# EAGLE design Starlings Technology nrf52 (EAGLE 9.6.2)
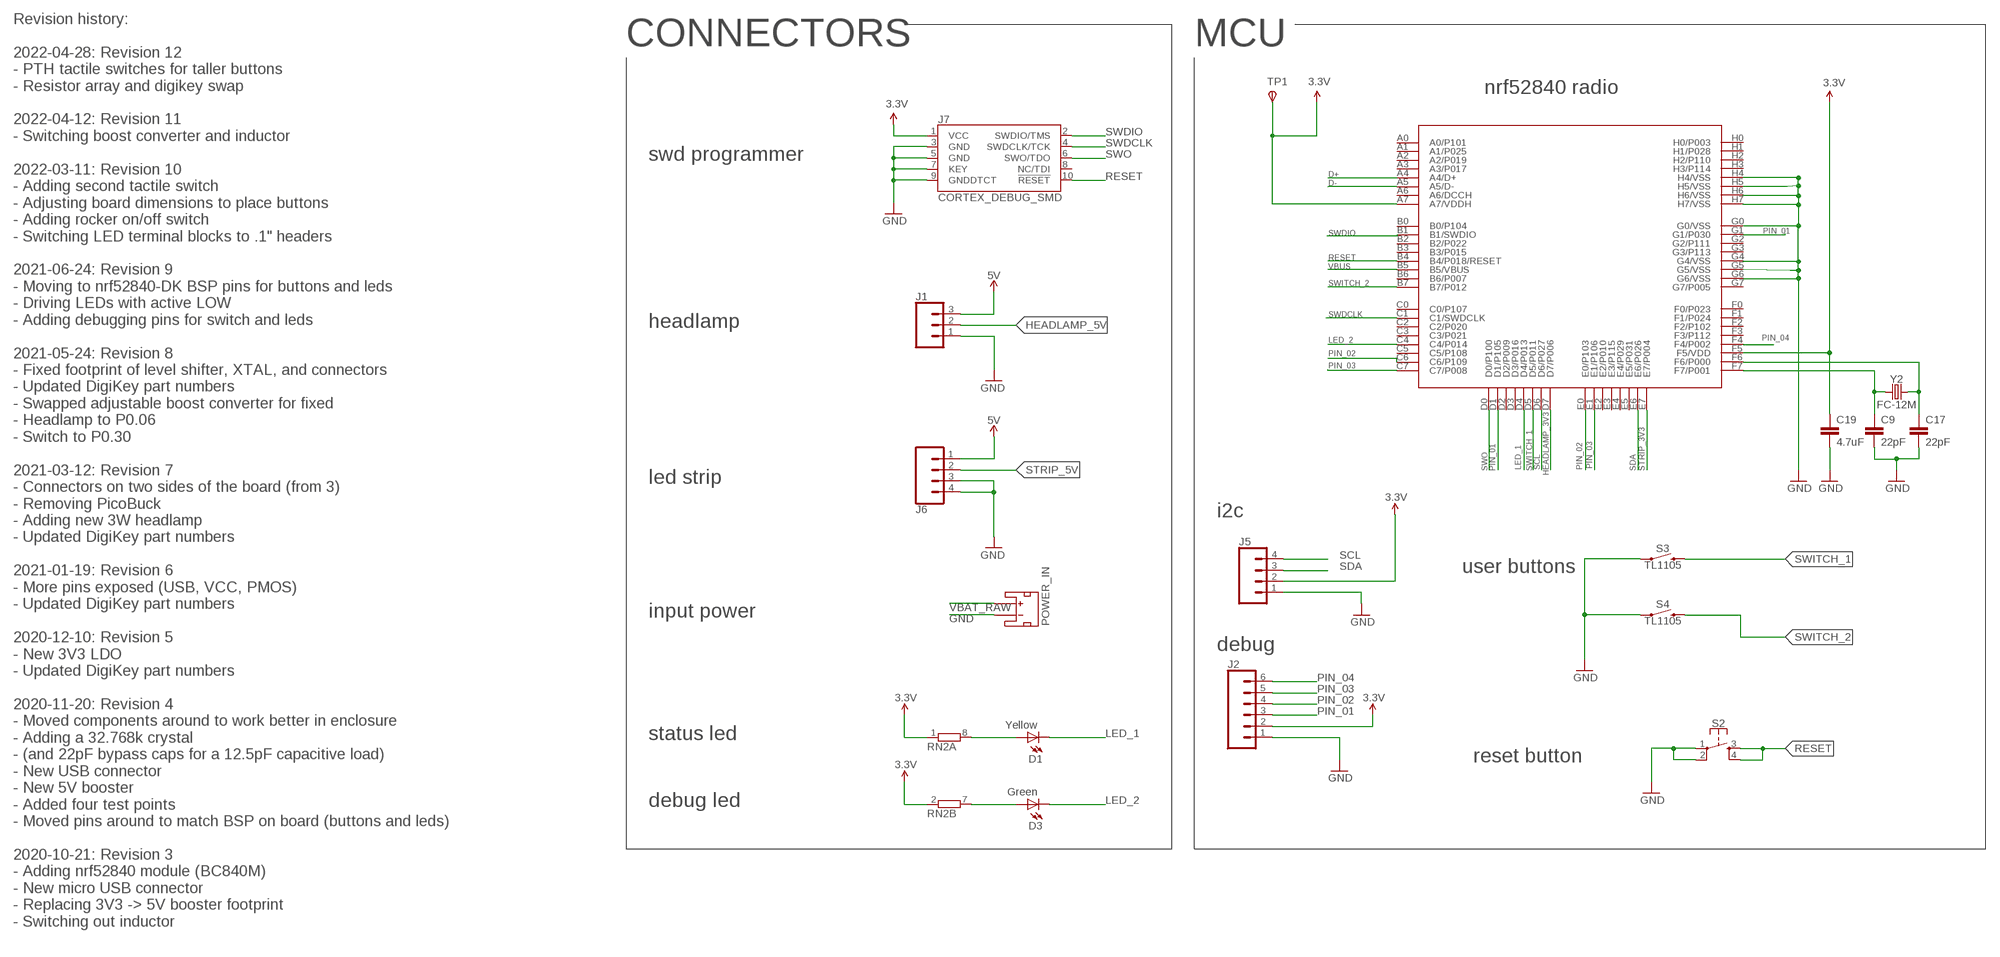
[diagram p0: schematic, sheet 1, part 1 of 2]
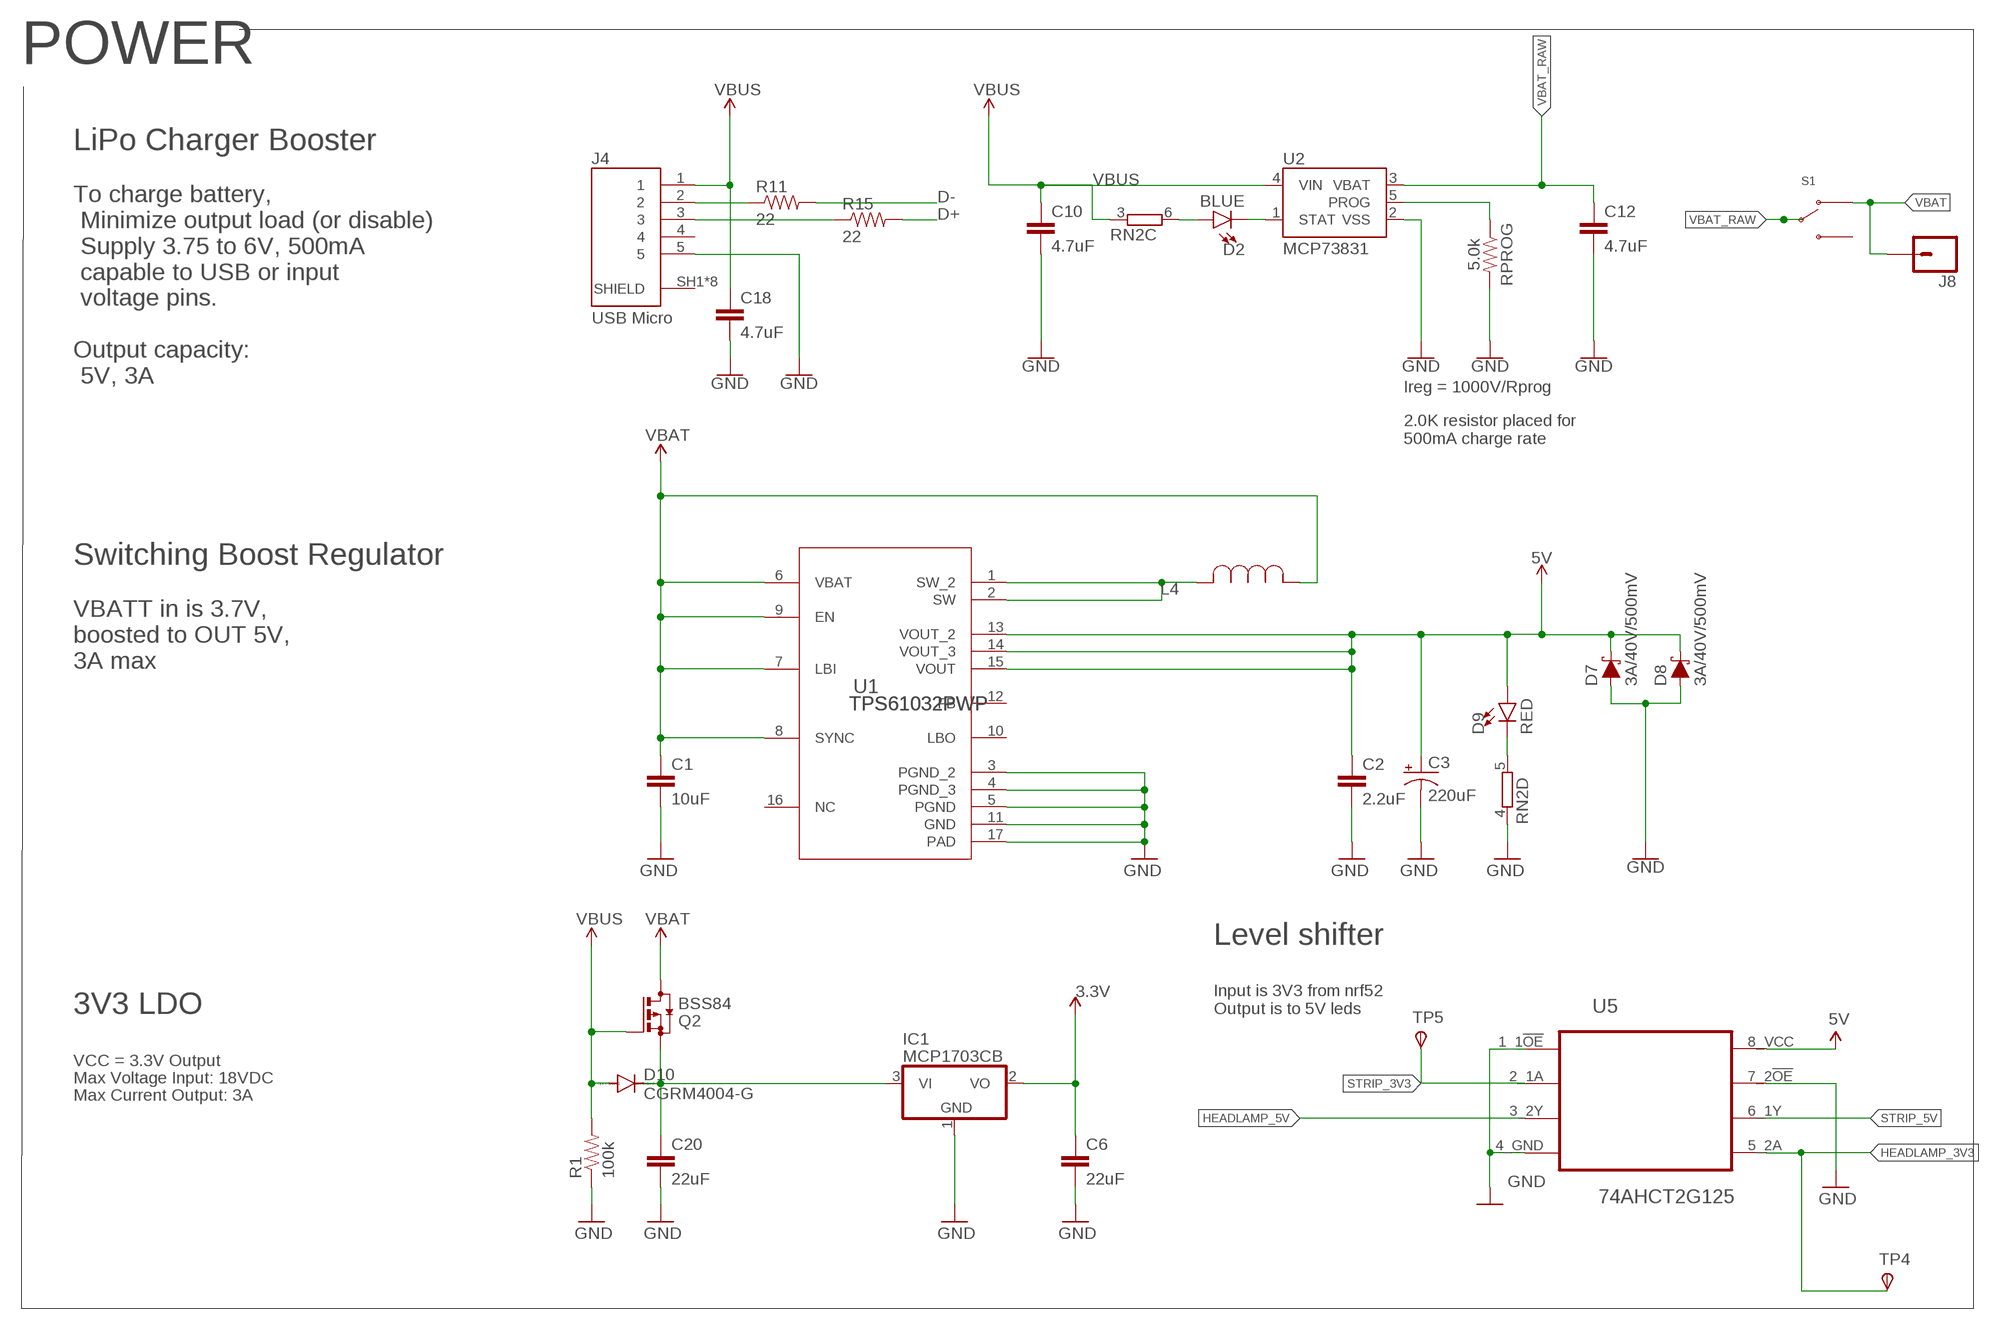
[diagram p1: schematic, sheet 1, part 2 of 2]

## Parts
C1  10uF  10UF-0603-6.3V-20%  [0603]
C2  2.2uF  10UF-0603-6.3V-20%  [0603]
C3  220uF  47UF-POLAR-EIA3528-10V-10%  [EIA3528]
C6  22uF  22UF-0805-6.3V-20%  [0805]
C9  22pF  22UF-0805-6.3V-20%  [0805]
C10  4.7uF  4.7UF0603  [0603]
C12  4.7uF  4.7UF0603  [0603]
C17  22pF  22UF-0805-6.3V-20%  [0805]
C18  4.7uF  4.7UF0603  [0603]
C19  4.7uF  4.7UF0603  [0603]
C20  22uF  22UF-0805-6.3V-20%  [0805]
D1  Yellow  LED0603  [LED-0603]
D2  BLUE  LED-BLUE0603  [LED-0603]
D3  Green  LED0603  [LED-0603]
D7  3A/40V/500mV  DIODE-SCHOTTKY-B340A  [SMA-DIODE]
D8  3A/40V/500mV  DIODE-SCHOTTKY-B340A  [SMA-DIODE]
D9  RED  LED-RED0603  [LED-0603]
D10  CGRM4004-G  [SOD-123_MINI-SMA]
IC1  MCP1703CB  [SOT23]
J1  CONN_03LOCK_LONGPADS  [1X03_LOCK_LONGPADS]
J2  CONN_06SMD-1MM  [1X06-1MM]
J4  USB Micro  1050170001  [MOLEX_1050170001]
J5  CONN_04SMD2  [1X04_1MM_RA]
J6  CONN_04LOCK_LONGPADS  [1X04_LOCK_LONGPADS]
J7  CORTEX_DEBUG_SMD  [SAMTECH_FTSH-105-01]
J8  CONN_01  [1X01]
L4  1.0 uH  SRR1260-330M  [IND_BOURNS_SRR1260]
POWER_IN  JST_2MM_MALE  [JST-2-SMD]
Q2  BSS84  [SOT23]
R1  100k  RESISTOR0603-RES  [0603-RES]
R11  22  RESISTOR0603-RES  [0603-RES]
R15  22  RESISTOR0603-RES  [0603-RES]
RN2  4R-NEXBS8V  [EXBS8V]
RPROG  5.0k  2.0KOHM-0603-1/10W-5%  [0603]
S1  CF-LD-1DC4-AR2W  [CF-LD-1DC4-AR2W]
S2  MOMENTARY-SWITCH-SPST-2-SMD-4.6X2.8MM  [TACTILE_SWITCH_SMD_4.6X2.8MM]
S3  TL1105  MOMENTARY-SWITCH-SPST-PTH-6.0MM  [TACTILE_SWITCH_PTH_6.0MM]
S4  TL1105  MOMENTARY-SWITCH-SPST-PTH-6.0MM  [TACTILE_SWITCH_PTH_6.0MM]
TP1  TPSB1,27  [B1,27]
TP4  TPSB1,27  [B1,27]
TP5  TPSB1,27  [B1,27]
U1  TPS61032PWP  [PWP0016K_N]
U2  MCP73831  [SOT23-5]
U3  BC840M  [BC840M]
U5  74AHCT2G125  VSSOP-8_DEVICE  [VSSOP-8]
Y2  FC-12M  [FC-12M]

## Nets
3.3V: C6.1 C19.1 IC1.2(VO) J2.2 J5.2 J7.1(VCC) RN2.1 RN2.2 TP1.TP(PP) U3.A7(A7/VDDH) U3.F5(F5/VDD) ; supply symbol labelled VCC
5V: C2.1 C3.A(+) D7.C D8.C D9.A J1.3 J6.1 U1.13(VOUT_2) U1.14(VOUT_3) U1.15(VOUT) U5.8_VCC
D+: R15.2 U3.A4(A4/D+)
D-: R11.2 U3.A5(A5/D-)
GND: C1.2 C2.2 C3.C(-) C6.2 C9.2 C10.2 C12.2 C17.2 C18.2 C19.2 C20.2 D7.A D8.A IC1.1(GND) J1.1 J2.1 J4.5 J5.1 J6.3 J6.4 J7.3(GND) J7.5(GND) J7.7(KEY) J7.9(GNDDTCT) POWER_IN.1(-) R1.1 RN2.4 RPROG.2 S2.1 S2.2 S3.1 S4.1 U1.3(PGND_2) U1.4(PGND_3) U1.5(PGND) U1.11(GND) U1.17(PAD) U2.2(VSS) U3.G0(G0/VSS) U3.G4(G4/VSS) U3.G5(G5/VSS) U3.G6(G6/VSS) U3.H4(H4/VSS) U3.H5(H5/VSS) U3.H6(H6/VSS) U3.H7(H7/VSS) U5.1_1!OE U5.4_GND U5.7_2!OE
HEADLAMP_3V3: TP4.TP(PP) U3.D7(D7/P006) U5.5_2A
HEADLAMP_5V: J1.2 U5.3_2Y
LED_1: D1.C U3.D4(D4/P013)
LED_2: D3.C U3.C4(C4/P014)
N$1: D1.A RN2.8
N$2: C9.1 U3.F7(F7/P001) Y2.1
N$3: L4.2 U1.1(SW_2) U1.2(SW)
N$4: C20.1 D10.C IC1.3(VI) Q2.2(S)
N$8: D3.A RN2.7
N$11: RPROG.1 U2.5(PROG)
N$12: J4.2 R11.1
N$13: D9.C RN2.5
N$14: D2.C U2.1(STAT)
N$15: D2.A RN2.6
N$16: J4.3 R15.1
N$17: C17.1 U3.F6(F6/P000) Y2.2
PIN_01: J2.3 U3.D1(D1/P105) U3.G1(G1/P030)
PIN_02: J2.4 U3.C6(C6/P109) U3.E0(E0/P103)
PIN_03: J2.5 U3.C7(C7/P008) U3.E1(E1/P106)
PIN_04: J2.6 U3.F4(F4/P002)
RESET: J7.10(!RESET) S2.3 S2.4 U3.B4(B4/P018/RESET)
SCL: J5.4 U3.D6(D6/P027)
SDA: J5.3 U3.E6(E6/P026)
STRIP_3V3: TP5.TP(PP) U3.E7(E7/P004) U5.2_1A
STRIP_5V: J6.2 U5.6_1Y
SWDCLK: J7.4(SWDCLK/TCK) U3.C1(C1/SWDCLK)
SWDIO: J7.2(SWDIO/TMS) U3.B1(B1/SWDIO)
SWITCH_1: S3.3 U3.D5(D5/P011)
SWITCH_2: S4.3 U3.B7(B7/P012)
SWO: J7.6(SWO/TDO) U3.D0(D0/P100)
VBAT: C1.1 J8.1 L4.1 Q2.3(D) S1.3 U1.6(VBAT) U1.7(LBI) U1.8(SYNC) U1.9(EN)
VBAT_RAW: C12.1 POWER_IN.2(+) S1.4 U2.3(VBAT)
VBUS: C10.1 C18.1 D10.A J4.1 Q2.1(G) R1.2 RN2.3 U2.4(VIN) U3.B5(B5/VBUS)
Unconnected: J4.4 J4.SH1(SHIELD) J4.SH2(SHIELD) J4.SH3(SHIELD) J4.SH4(SHIELD) J4.SH5(SHIELD) J4.SH6(SHIELD) J4.SH7(SHIELD) J4.SH8(SHIELD) J7.8(NC/TDI) POWER_IN.NC1(PAD1) POWER_IN.NC2(PAD2) U1.10(LBO) U1.12(FB) U1.16(NC) U3.A0(A0/P101) U3.A1(A1/P025) U3.A2(A2/P019) U3.A3(A3/P017) U3.A6(A6/DCCH) U3.B0(B0/P104) U3.B2(B2/P022) U3.B3(B3/P015) U3.B6(B6/P007) U3.C0(C0/P107) U3.C2(C2/P020) U3.C3(C3/P021) U3.C5(C5/P108) U3.D2(D2/P009) U3.D3(D3/P016) U3.E2(E2/P010) U3.E3(E3/P115) U3.E4(E4/P029) U3.E5(E5/P031) U3.F0(F0/P023) U3.F1(F1/P024) U3.F2(F2/P102) U3.F3(F3/P112) U3.G2(G2/P111) U3.G3(G3/P113) U3.G7(G7/P005) U3.H0(H0/P003) U3.H1(H1/P028) U3.H2(H2/P110) U3.H3(H3/P114)

## Notes on the sheet
- Revision history:
  
  2022-04-28: Revision 12
  - PTH tactile switches for taller buttons
  - Resistor array and digikey swap
  
  2022-04-12: Revision 11
  - Switching boost converter and inductor
  
  2022-03-11: Revision 10
  - Adding second tactile switch
  - Adjusting board dimensions to place buttons
  - Adding rocker on/off switch
  - Switching LED terminal blocks to .1" headers
  
  2021-06-24: Revision 9
  - Moving to nrf52840-DK BSP pins for buttons and leds
  - Driving LEDs with active LOW
  - Adding debugging pins for switch and leds
  
  2021-05-24: Revision 8
  - Fixed footprint of level shifter, XTAL, and connectors
  - Updated DigiKey part numbers
  - Swapped adjustable boost converter for fixed
  - Headlamp to P0.06
  - Switch to P0.30
  
  2021-03-12: Revision 7
  - Connectors on two sides of the board (from 3)
  - Removing PicoBuck
  - Adding new 3W headlamp
  - Updated DigiKey part numbers
  
  2021-01-19: Revision 6
  - More pins exposed (USB, VCC, PMOS)
  - Updated DigiKey part numbers
  
  2020-12-10: Revision 5
  - New 3V3 LDO
  - Updated DigiKey part numbers
  
  2020-11-20: Revision 4
  - Moved components around to work better in enclosure
  - Adding a 32.768k crystal 
  - (and 22pF bypass caps for a 12.5pF capacitive load) 
  - New USB connector
  - New 5V booster
  - Added four test points
  - Moved pins around to match BSP on board (buttons and leds)
  
  2020-10-21: Revision 3
  - Adding nrf52840 module (BC840M)
  - New micro USB connector
  - Replacing 3V3 -> 5V booster footprint
  - Switching out inductor
- CONNECTORS | MCU | POWER
- nrf52840 radio
- LiPo Charger Booster
- To charge battery,
   Minimize output load (or disable)
   Supply 3.75 to 6V, 500mA
   capable to USB or input
   voltage pins.
- swd programmer
- Output capacity:
   5V, 3A
- Ireg = 1000V/Rprog
- 2.0K resistor placed for
  500mA charge rate
- headlamp
- Switching Boost Regulator
- VBATT in is 3.7V, 
  boosted to OUT 5V, 
  3A max
- led strip
- i2c
- user buttons
- input power
- Level shifter
- debug
- 3V3 LDO
- Input is 3V3 from nrf52
  Output is to 5V leds
- VCC = 3.3V Output
- Max Voltage Input: 18VDC
- Max Current Output: 3A
- status led
- reset button
- debug led

## Power pins joined to a net without a drawn wire
6: S1.5

## Library data of the parts
C1 = SparkFun-Capacitors:10UF: 10.0µF ceramic capacitors A capacitor is a passive two-terminal electrical component used to store electrical energy temporarily in an electric field.; DIGIKEY: 587-1256-1-ND; PROD_ID: CAP-11015
C2 = SparkFun-Capacitors:10UF: 10.0µF ceramic capacitors A capacitor is a passive two-terminal electrical component used to store electrical energy temporarily in an electric field.; DIGIKEY: 1276-1040-1-ND; PROD_ID: CAP-11015; VALUE: 10uF
C3 = SparkFun-Capacitors:47UF-POLAR: 47µF polarized capacitors A capacitor is a passive two-terminal electrical component used to store electrical energy temporarily in an electric field.; DIGIKEY: 718-1106-1-ND; PROD_ID: CAP-08310; VALUE: 47uF
C6 C20 = SparkFun-Capacitors:22UF: 22µF ceramic capacitors A capacitor is a passive two-terminal electrical component used to store electrical energy temporarily in an electric field.; DIGIKEY: 490-10511-1-ND; PROD_ID: CAP-08402
C9 C17 = SparkFun-Capacitors:22UF: 22µF ceramic capacitors A capacitor is a passive two-terminal electrical component used to store electrical energy temporarily in an electric field.; DIGIKEY: 399-C0805C220K5HAC7800CT-ND; PROD_ID: CAP-08402; VALUE: 22uF
C10 C12 C18 C19 = SparkFun-Capacitors:4.7UF: 4.7µF ceramic capacitors A capacitor is a passive two-terminal electrical component used to store electrical energy temporarily in an electric field.; DIGIKEY: 399-3482-1-ND; PROD_ID: CAP-08280
D1 = SparkFun:LED: LEDs Standard schematic elements and footprints for 5mm, 3mm, 1206, and 0603 sized LEDs. 5mm - Spark Fun Electronics SKU : COM-00529 (and others); DIGIKEY: 350-4349-2-ND
D2 = SparkFun-LED:LED-BLUE: Blue SMD LED Used in manufacturing of various products at SparkFun Packages: 0603 - SMD 0603 package [Product Link] <http://www.digikey.com/product-detail/en/SMLE12BC7TT86/511-1589-2-ND/1641808> 1206 - SMD1206 package [Product Link] <http://www.digikey.com/product-detail/en/lite-on-inc/LTST-C150TBKT/160-1643-1-ND/573584> SparkFun Products: ESP8266 Thing-Dev Board <https://www.sparkfun.com/products/13711> RedBoard <https://www.sparkfun.com/products/12757>; DIGIKEY: 160-1647-1-ND; PROD_ID: DIO-08575
D3 = SparkFun:LED: LEDs Standard schematic elements and footprints for 5mm, 3mm, 1206, and 0603 sized LEDs. 5mm - Spark Fun Electronics SKU : COM-00529 (and others); DIGIKEY: 754-1116-1-ND
D7 D8 = SparkFun-DiscreteSemi:DIODE-SCHOTTKY: Schottky diode A Schottky diode is a semiconductor diode which has a low forward voltage drop and a very fast switching action.; DIGIKEY: 3757-SBA130AS_R1_00001TR-ND; PROD_ID: DIO-09886
D9 = SparkFun-LED:LED-RED: Red SMD LED Used in manufacturing of most products at SparkFun Packages: 0603 - SMD 0603 package [Product Link] <http://docs.avagotech.com/docs/AV02-0551EN> 0603 SMART - SMD 0603 SMART package ( more efficient and expensive)[Product Link] <http://www.osram-os.com/Graphics/XPic2/00077099_0.pdf> 1206 - SMD1206 package [Product Link] <https://www.sparkfun.com/datasheets/DevTools/LilyPad/Q150OVS4.pdff> SparkFun Products: Pro Mini 328 -5V <https://www.sparkfun.com/products/821> RedBoard <https://www.sparkfun.com/products/12757> IOIO-OTG <https://www.sparkfun.com/products/13613>; DIGIKEY: 160-1436-1-ND; PROD_ID: DIO-00819
D10 = diode:CGRM400*-G: Molded plasitc,JEDEC SOD-123/Mini SMA Source: Comchip CGRM4001-G.pdf; DIGIKEY: 3757-SBA130AS_R1_00001TR-ND
IC1 = linear:MCP1703: 250 mA, 16V, Low Quiescent Current LDO Regulator Source: http://ww1.microchip.com/downloads/en/DeviceDoc/22049b.pdf; DIGIKEY: AP2138N-3.3TRG1DICT-ND
J1 = SparkFun-Connectors:CONN_03: Multi connection point. Often used as Generic Header-pin footprint for 0.1 inch spaced/style header connections On any of the 0.1 inch spaced packages, you can populate with these: Break Away Headers - Straight <https://www.sparkfun.com/products/116> (PRT-00116) Break Away Male Headers - Right Angle <https://www.sparkfun.com/products/553> (PRT-00553) Female Headers <https://www.sparkfun.com/products/115> (PRT-00115) Break Away Headers - Machine Pin <https://www.sparkfun.com/products/117> (PRT-00117) Break Away Female Headers - Swiss Machine Pin <https://www.sparkfun.com/products/743> (PRT-00743) Stackable Header - 3 Pin (Female, 0.1") <https://www.sparkfun.com/products/13875> (PRT-13875) For SCREWTERMINALS and SPRING TERMINALS visit here: Screw Terimnals on SparkFun.com <https://www.sparkfun.com/search/results?term=Screw+Terminals> (5mm/3.5mm/2.54mm spacing) This device is also useful as a general connection point to wire up your design to another part of your project. Our various solder wires solder well into these plated through hole pads. Hook-Up Wire - Assortment (Stranded, 22 AWG) <https://www.sparkfun.com/products/11375> (PRT-11375) Hook-Up Wire - Assortment (Solid Core, 22 AWG) <https://www.sparkfun.com/products/11367> (PRT-11367) View the entire wire category on our website here <https://www.sparkfun.com/categories/141> Special notes: Molex polarized connector foot print use with SKU : PRT-08232 with associated crimp pins and housings.; DIGIKEY: S1111EC-03-ND
J2 = SparkFun-Connectors:CONN_06: Multi connection point. Often used as Generic Header-pin footprint for 0.1 inch spaced/style header connections On any of the 0.1 inch spaced packages, you can populate with these: Break Away Headers - Straight <https://www.sparkfun.com/products/116> (PRT-00116) Break Away Male Headers - Right Angle <https://www.sparkfun.com/products/553> (PRT-00553) Female Headers <https://www.sparkfun.com/products/115> (PRT-00115) Break Away Headers - Machine Pin <https://www.sparkfun.com/products/117> (PRT-00117) Break Away Female Headers - Swiss Machine Pin <https://www.sparkfun.com/products/743> (PRT-00743) Arduino Stackable Header - 6 Pin <https://www.sparkfun.com/products/9280> (PRT-09280) For SCREWTERMINALS and SPRING TERMINALS visit here: Screw Terimnals on SparkFun.com <https://www.sparkfun.com/search/results?term=Screw+Terminals> (5mm/3.5mm/2.54mm spacing) This device is also useful as a general connection point to wire up your design to another part of your project. Our various solder wires solder well into these plated through hole pads. Hook-Up Wire - Assortment (Stranded, 22 AWG) <https://www.sparkfun.com/products/11375> (PRT-11375) Hook-Up Wire - Assortment (Solid Core, 22 AWG) <https://www.sparkfun.com/products/11367> (PRT-11367) View the entire wire category on our website here <https://www.sparkfun.com/categories/141>; PROD_ID: CONN-08249; SF_ID: GPS-00579
J4 = 1050170001:1050170001: Conn.; Data; USB; Recept.; Micro; B Type; Bottom Mount, SMT, with Solder Tabs, Lead-Free Check prices <https://pricing.snapeda.com/parts/1050170001/Molex/view-part?ref=eda>; AVAILABILITY: Good; DESCRIPTION: USB - micro B USB 2.0 Receptacle Connector 5 Position Surface Mount, Right Angle; Through Hole; DIGIKEY: WM1399CT-ND; MF: Molex; MP: 1050170001; PACKAGE: None; PRICE: None; PURCHASE-URL: https://pricing.snapeda.com/search/part/1050170001/?ref=eda
J5 = SparkFun-Connectors:CONN_04: Multi connection point. Often used as Generic Header-pin footprint for 0.1 inch spaced/style header connections On any of the 0.1 inch spaced packages, you can populate with these: Break Away Headers - Straight <https://www.sparkfun.com/products/116> (PRT-00116) Break Away Male Headers - Right Angle <https://www.sparkfun.com/products/553> (PRT-00553) Female Headers <https://www.sparkfun.com/products/115> (PRT-00115) Break Away Headers - Machine Pin <https://www.sparkfun.com/products/117> (PRT-00117) Break Away Female Headers - Swiss Machine Pin <https://www.sparkfun.com/products/743> (PRT-00743) For SCREWTERMINALS and SPRING TERMINALS visit here: Screw Terimnals on SparkFun.com <https://www.sparkfun.com/search/results?term=Screw+Terminals> (5mm/3.5mm/2.54mm spacing) This device is also useful as a general connection point to wire up your design to another part of your project. Our various solder wires solder well into these plated through hole pads. Hook-Up Wire - Assortment (Stranded, 22 AWG) <https://www.sparkfun.com/products/11375> (PRT-11375) Hook-Up Wire - Assortment (Solid Core, 22 AWG) <https://www.sparkfun.com/products/11367> (PRT-11367) View the entire wire category on our website here <https://www.sparkfun.com/categories/141> Special notes: Molex polarized connector foot print use with SKU : PRT-08231 with associated crimp pins and housings. 1MM SMD Version SKU: PRT-10208; PROD_ID: CONN-10310; SF_ID: PRT-10208
J6 = SparkFun-Connectors:CONN_04: Multi connection point. Often used as Generic Header-pin footprint for 0.1 inch spaced/style header connections On any of the 0.1 inch spaced packages, you can populate with these: Break Away Headers - Straight <https://www.sparkfun.com/products/116> (PRT-00116) Break Away Male Headers - Right Angle <https://www.sparkfun.com/products/553> (PRT-00553) Female Headers <https://www.sparkfun.com/products/115> (PRT-00115) Break Away Headers - Machine Pin <https://www.sparkfun.com/products/117> (PRT-00117) Break Away Female Headers - Swiss Machine Pin <https://www.sparkfun.com/products/743> (PRT-00743) For SCREWTERMINALS and SPRING TERMINALS visit here: Screw Terimnals on SparkFun.com <https://www.sparkfun.com/search/results?term=Screw+Terminals> (5mm/3.5mm/2.54mm spacing) This device is also useful as a general connection point to wire up your design to another part of your project. Our various solder wires solder well into these plated through hole pads. Hook-Up Wire - Assortment (Stranded, 22 AWG) <https://www.sparkfun.com/products/11375> (PRT-11375) Hook-Up Wire - Assortment (Solid Core, 22 AWG) <https://www.sparkfun.com/products/11367> (PRT-11367) View the entire wire category on our website here <https://www.sparkfun.com/categories/141> Special notes: Molex polarized connector foot print use with SKU : PRT-08231 with associated crimp pins and housings. 1MM SMD Version SKU: PRT-10208; DIGIKEY: S1111EC-04-ND; PROD_ID: CONN-09696
J7 = SparkFun-Connectors:CORTEX_DEBUG: Cortex Debug Connector - 10 pin Supports JTAG debug, Serial Wire debug, and Serial Wire Viewer. PTH and SMD connector options available. General Connector Information <http://infocenter.arm.com/help/topic/com.arm.doc.faqs/attached/13634/cortex_debug_connectors.pdf> Products: PTH Connector <http://www.digikey.com/product-detail/en/cnc-tech/3220-10-0100-00/1175-1627-ND/3883661> -via Digi-Key SparkFun PSoc <https://www.sparkfun.com/products/13229> SparkFun T <https://www.sparkfun.com/products/13810>; DIGIKEY: SAM1161-05-ND
J8 = SparkFun-Connectors:CONN_01: Single connection point. Often used as Generic Header-pin footprint for 0.1 inch spaced/style header connections On any of the 0.1 inch spaced packages, you can populate with these: Break Away Headers - Straight <https://www.sparkfun.com/products/116> (PRT-00116) Break Away Male Headers - Right Angle <https://www.sparkfun.com/products/553> (PRT-00553) Female Headers <https://www.sparkfun.com/products/115> (PRT-00115) Break Away Headers - Machine Pin <https://www.sparkfun.com/products/117> (PRT-00117) Break Away Female Headers - Swiss Machine Pin <https://www.sparkfun.com/products/743> (PRT-00743) This device is also useful as a general connection point to wire up your design to another part of your project. Our various solder wires solder well into these plated through hole pads. Hook-Up Wire - Assortment (Stranded, 22 AWG) <https://www.sparkfun.com/products/11375> (PRT-11375) Hook-Up Wire - Assortment (Solid Core, 22 AWG) <https://www.sparkfun.com/products/11367> (PRT-11367) View the entire wire category on our website here <https://www.sparkfun.com/categories/141> Special notes: SMTSO-256-ET is a "flush mount" nut for a 4-40 screw. We mostly use this on specialty testbeds; it is a nice way to connect hardware to your PCB at an adjustable hieght. Also note, the SNAP packages are for using a snappable style connector. We sell a baggie of snaps and they are also used on two LilyPad designs: Snap Assortment - 30 pack (male and female) <https://www.sparkfun.com/products/11347> (DEV-11347) LilyPad Arduino SimpleSnap <https://www.sparkfun.com/products/10941> (DEV-10941) LilyPad SimpleSnap Protoboard <https://www.sparkfun.com/products/10940> (DEV-10940)
L4 = 12mm Inductor:SRR1260-330M; COPYRIGHT: Copyright (C) 2022 Ultra Librarian. All rights reserved.; DIGIKEY: 308-1937-2-ND; MANUFACTURER_PART_NUMBER: SRR1260-330M; MFR_NAME: Bourns Electronics
POWER_IN = SparkFun-Connectors:JST_2MM_MALE: JST 2MM MALE RA CONNECTOR Two pin, compact surface mount connector. Commonly used as a battery input connection point. We really like the solid locking feeling and high current rating on these small connectors. We use these all the time as battery connectors. Mates to single-cell LiPo batteries. Here is the connector we sell at SparkFun: JST Right Angle Connector - White <https://www.sparkfun.com/products/8612> (PRT-08612) Datasheet <http://www.sparkfun.com/datasheets/Prototyping/Connectors/JST-Horizontal.pdf> It was used on these SparkFun products: SparkFun MOSFET Power Controller <https://www.sparkfun.com/products/11214> (PRT-11214) SparkFun Battery Babysitter - LiPo Battery Manager <https://www.sparkfun.com/products/13777> (PRT-13777) And many, many others that required a lipo battery connection.; DIGIKEY: 732-2711-1-ND; PROD_ID: CONN-11443; SF_ID: PRT-08612
Q2 = transistor-small-signal:BSS84: P-CHANNEL MOS FET; DIGIKEY: DMP2215LDICT-ND
R1 = SparkFun:RESISTOR: Resistor Basic schematic elements and footprints for 0603, 1206, and PTH resistors.; DIGIKEY: RMCF0603FG100KCT-ND
R11 = SparkFun:RESISTOR: Resistor Basic schematic elements and footprints for 0603, 1206, and PTH resistors.; DIGIKEY: 311-22.0HRTR-ND
R15 = SparkFun:RESISTOR: Resistor Basic schematic elements and footprints for 0603, 1206, and PTH resistors.; DIGIKEY: 311-22.0HRCT-ND
RN2 = resistor-dil:4R-N: Array Chip Resistor Source: RS Component / Phycomp; DIGIKEY: YC324J-1.0KCT-ND; OC_FARNELL: unknown; OC_NEWARK: unknown
RPROG = SparkFun-Resistors:2.0KOHM: 2kΩ resistor A resistor is a passive two-terminal electrical component that implements electrical resistance as a circuit element. Resistors act to reduce current flow, and, at the same time, act to lower voltage levels within circuits. - Wikipedia; DIGIKEY: RMCF0603JT2K00CT-ND; PROD_ID: RES-08296; VALUE: 2.0k
S1 = RA1122DWR:CF-LD-1DC4-AR2W; DIGIKEY: 563-1946-ND
S2 = SparkFun-Switches:MOMENTARY-SWITCH-SPST-2: Momentary Switch (Pushbutton) - SPST - Two Circuits Normally-open (NO) SPST momentary switches (buttons, pushbuttons). Schematic symbol includes two switch circuits. Variants SMD-4.6MMX2.8MM - 4.60mm x 2.80mm Tactile Momentary Button Switch - Used on SparkFun SAMD21 Mini Breakout <https://www.sparkfun.com/products/13664> SMD-5.2MM - Mini Pushbutton Switch - SMD <https://www.sparkfun.com/products/8720> - Used on Arduino Pro Mini <https://www.sparkfun.com/products/11114>; DIGIKEY: 401-1426-1-ND; PROD_ID: SWCH-13065
S3 S4 = SparkFun-Switches:MOMENTARY-SWITCH-SPST: Momentary Switch (Pushbutton) - SPST Normally-open (NO) SPST momentary switches (buttons, pushbuttons). Variants PTH-12MM - 12mm square, through-hole Momentary Pushbutton Switch - 12mm Square <https://www.sparkfun.com/products/9190> (COM-09190) PTH-6.0MM, PTH-6.0MM-KIT - 6.0mm square, through-hole Mini Pushbutton Switch <https://www.sparkfun.com/products/97> (COM-00097) KIT package intended for soldering kit's - only one side of pads' copper is exposed. PTH-RIGHT-ANGLE-KIT - Right-angle, through-hole Right Angle Tactile Button <https://www.sparkfun.com/products/10791> - Used on SparkFun BigTime Watch Kit <https://www.sparkfun.com/products/11734> SMD-12MM - 12mm square, surface-mount Tactile Button - SMD (12mm) <https://www.sparkfun.com/products/12993> (COM-12993) Used on SparkFun PicoBoard <https://www.sparkfun.com/products/11888> SMD-4.5MM - 4.5mm Square Trackball Switch Used on SparkFun Blackberry Trackballer Breakout <https://www.sparkfun.com/products/13169> SMD-4.6MMX2.8MM - 4.60mm x 2.80mm, surface mount Used on SparkFun SAMD21 Mini Breakout <https://www.sparkfun.com/products/13664> SMD-5.2MM, SMD-5.2-REDUNDANT - 5.2mm square, surface-mount Mini Pushbutton Switch - SMD <https://www.sparkfun.com/products/8720> (COM-08720) Used on Arduino Pro Mini <https://www.sparkfun.com/products/11114> REDUNDANT package connects both switch circuits together SMD-6.0X3.5MM - 6.0 x 3.5mm, surface mount Momentary Reset Switch SMD <https://www.sparkfun.com/products/8229> (COM-08229) SMD-6.2MM-TALL - 6.2mm square, surface mount Tactile Button - SMD (6mm) <https://www.sparkfun.com/products/12992> Used on SparkFun Digital Sandbox <https://www.sparkfun.com/products/12651> SMD-RIGHT-ANGLE - Right-angle, surface mount Used on SparkFun Block for Intel® Edison - Arduino <https://www.sparkfun.com/products/13036>; DIGIKEY: EG2506-ND; PROD_ID: SWCH-08441; SF_SKU: COM-00097
TP1 TP4 TP5 = testpad:TPS: TEST PIN
U1 = TPS61031PWPR:TPS61032PWP; COPYRIGHT: Copyright (C) 2022 Ultra Librarian. All rights reserved.; DIGI-KEY_PART_NUMBER_1: 296-27007-5-ND; DIGI-KEY_PART_NUMBER_2: 2156-TPS61032PWP-ND; MANUFACTURER_PART_NUMBER: TPS61032PWP; MFR_NAME: Texas Instruments; REFDES: RefDes; TYPE: TYPE
U2 = SparkFun-IC-Power:MCP73831: MCP73831T Li-Ion, Li-Pol Controller Miniature single cell, fully integrated Li-Ion, Li-polymer charge management controller Datasheet <http://ww1.microchip.com/downloads/en/DeviceDoc/20001984g.pdf> SparkFun Products: SparkFun ESP32 Thing <https://www.sparkfun.com/products/13907> SparkFun 9DoF Razor IMU M0 <https://www.sparkfun.com/products/14001>; DIGIKEY: 497-5809-1-ND; PROD_ID: IC-09995
U3 = BC840M-v1:BC840M; DIGIKEY: 1914-BC840MCT-ND
U5 = VSSOP8:VSSOP-8_DEVICE: Dual bidirectional I2C-bus and SMBus voltage-level translator; DIGIKEY: 1727-6544-1-ND‎; MPN: PCA9306DC,125; OC_FARNELL: -; OC_NEWARK: 70R6429; PACKAGE: VSSOP-8; SUPPLIER: NXP
Y2 = crystal:FC-12M: kHz RANGE CRYSTAL UNIT LOW PROFILE SMD Source: Epson Toyocom FC-12M.pdf; DIGIKEY: 2195-CM8V-T1A-32.768KHZ-12.5PF-20PPM-TA-QATR-ND

## Net classes
0 default: width 0.127 mm, drill 0.305 mm, clearance 0.152 mm
1 power: width 0.508 mm

## Board
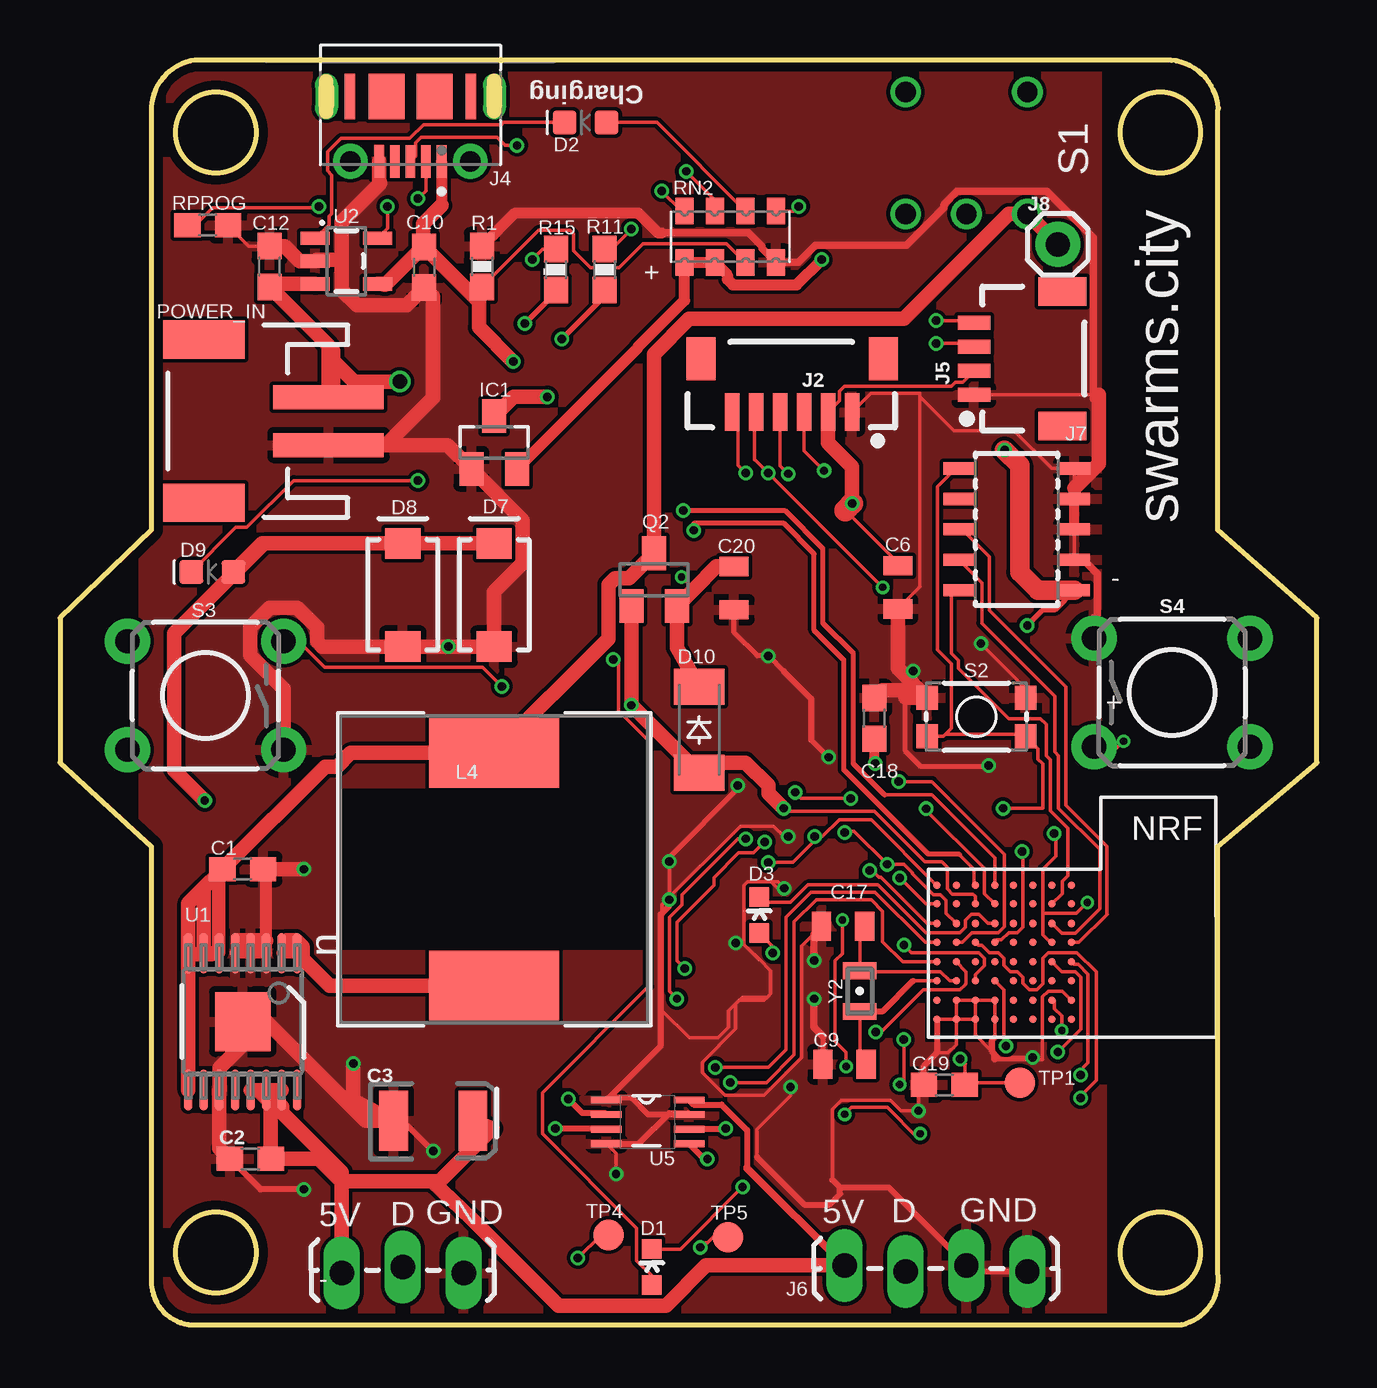
[diagram p2: board, top side]
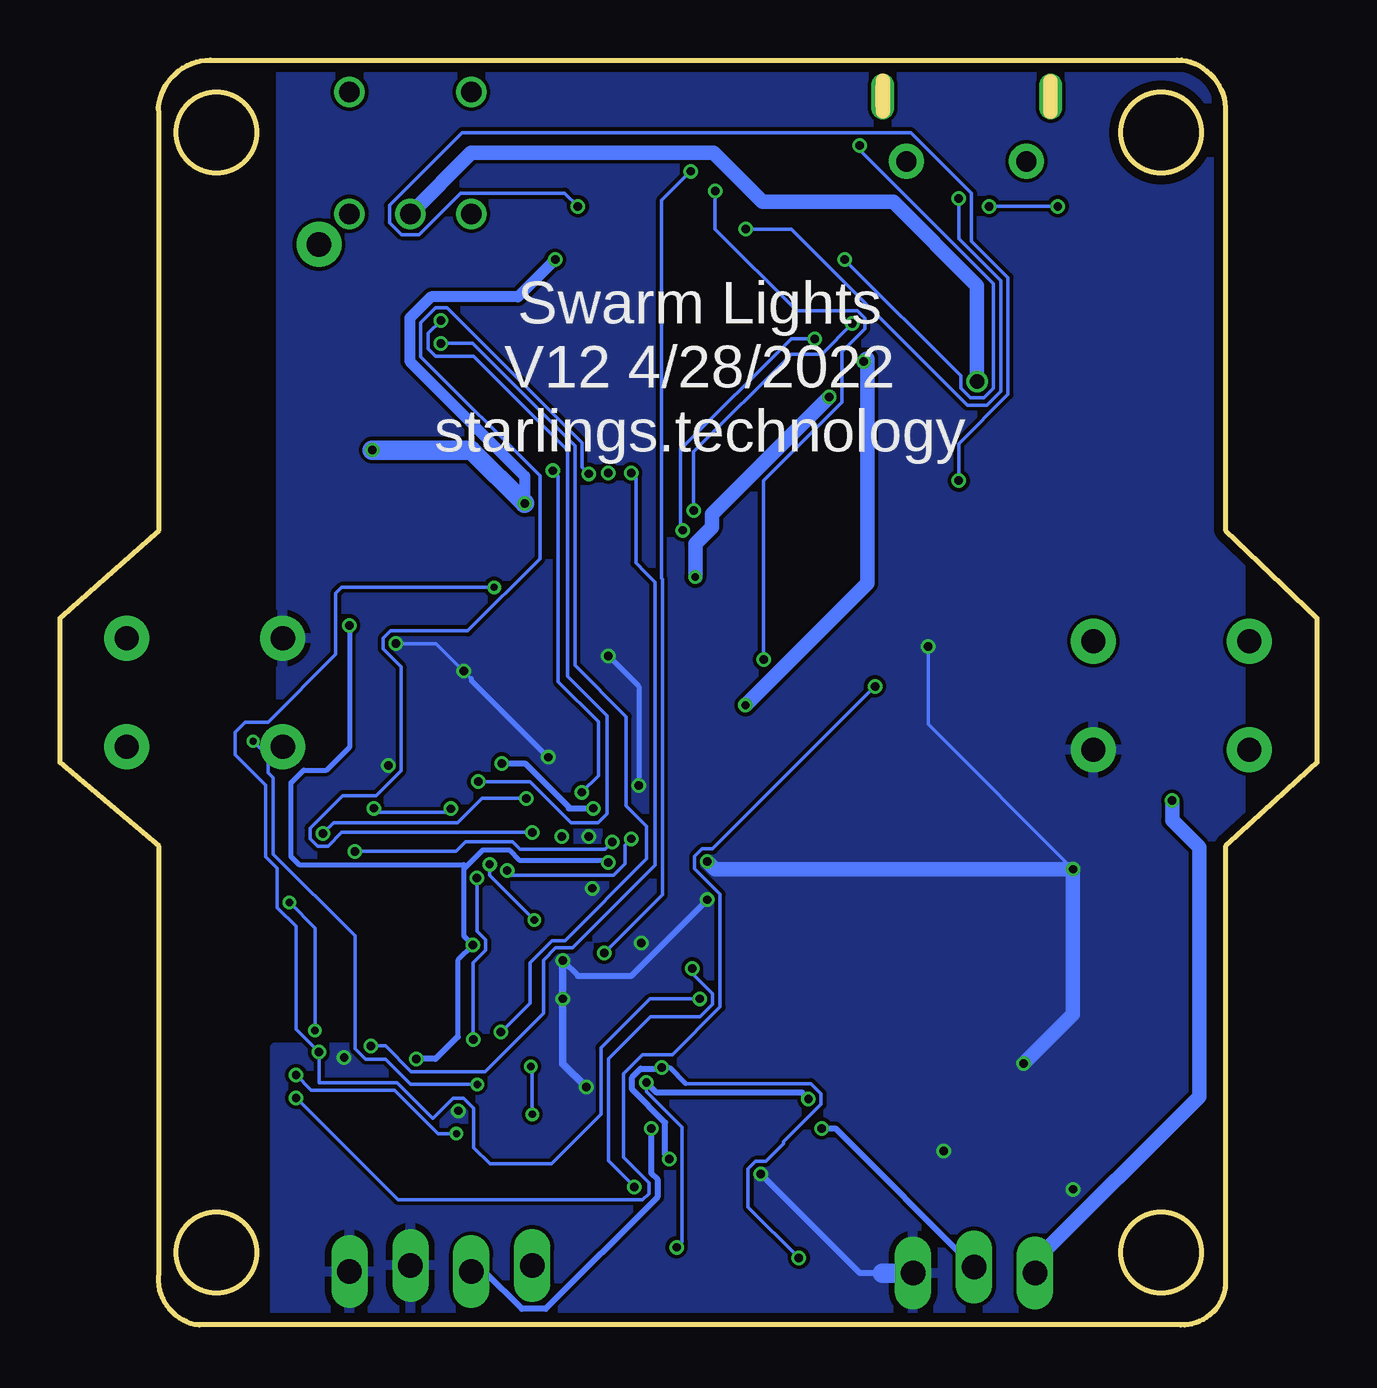
[diagram p3: board, bottom side, seen from below]

Size 52.39 x 52.7 mm. Coordinates in mm from the lower left corner, seen from the top.
Outline: 3.81,50.54 3.81,33.12 0,29.46 0,23.43 3.81,19.94 3.81,1.72 arc90 5.69,0 46.57,0 46.76,0.01 arc85 48.26,2.17 48.26,19.94 52.39,23.43 52.39,29.46 48.26,33.12 48.26,50.54 48.28,50.7 arc85 46.12,52.7 5.82,52.7 5.63,52.7 arc85 3.81,50.54
Outline: circle at 45.86,49.69 radius 1.68
Outline: circle at 6.49,3.02 radius 1.68
Outline: circle at 6.49,49.69 radius 1.68
Outline: circle at 45.86,3.02 radius 1.68
Copper layers (1*16): Top 0.035559375mm / dielectric 1.6mm / Bottom 0.035559375mm
Design rules "oshpark-2layer-tented": minimum track width 6mil, minimum drill 10mil, track to track 6mil, track to pad 6mil, pad to pad 6mil, via to via 6mil, smd to smd 6mil, copper to edge 15mil, drill to drill 6mil, minimum pad ring 5mil, minimum via ring 5mil, stop-mask expansion 2.5mil, vias tented up to drill 20mil, thermal gap 10mil

### Footprints (pad centres in the part's own frame; a part is rotated, then mirrored left to right if it is on the bottom)
0603 = smd 1.1 x 1: 1 -0.85,0; 2 0.85,0
EIA3528 = smd 1.2 x 2.5: A 1.65,0; C -1.65,0
0805 = smd 0.8 x 1.2: 1 -0.9,0; 2 0.9,0
LED-0603 = smd 0.8 x 0.8: A 0,-0.75; C 0,0.75
LED-0603' = smd 1 x 1: A -0.877,0; C 0.877,0
SMA-DIODE = smd 1.27 x 1.47: A -2.15,0; C 2.15,0
SOD-123_MINI-SMA = smd 1.5 x 2.1: A 1.8,0; C -1.8,0
SOT23 = smd 1 x 1.4: 1 -0.95,-1.1; 2 0.95,-1.1; 3 0,1.1
1X03_LOCK_LONGPADS = drill 1.016 long: 1 0,0; 2 2.54,-0.254; 3 5.08,0
1X06-1MM = smd 0.6 x 1.55: 1 -2.54,1.27; 2 -1.54,1.27; 3 -0.54,1.27; 4 0.46,1.27; 5 1.46,1.27; 6 2.46,1.27 | smd 1.2 x 1.8: P$1 -3.84,-0.955; P$2 3.76,-0.955
MOLEX_1050170001 = smd 0.4 x 1.35: 1 -1.3,2.35; 2 -0.65,2.35; 3 0,2.35; 4 0.65,2.35; 5 1.3,2.35 | drill 0.85 pad 1.45: SH1 -2.5,2.35; SH2 2.5,2.35 | drill 0.6 pad 0.95 long: SH3 -3.5,-0.35; SH8 3.5,-0.35 | smd 0.438 x 1.9: SH4 -2.519,-0.35; SH7 2.519,-0.35 | smd 1.5 x 1.9: SH5 -1,-0.35; SH6 1,-0.35
1X04_1MM_RA = smd 0.6 x 1.35: 1 -1.5,0; 2 -0.5,0; 3 0.5,0; 4 1.5,0 | smd 1.2 x 2: NC1 2.8,-3.675; NC2 -2.8,-3.675
1X04_LOCK_LONGPADS = drill 1.016 long: 1 0,0; 2 2.54,-0.254; 3 5.08,0; 4 7.62,-0.254
SAMTECH_FTSH-105-01 = smd 0.508 x 1.27: 1 -2.54,-2.413; 2 -2.54,2.413; 3 -1.27,-2.413; 4 -1.27,2.413; 5 0,-2.413; 6 0,2.413; 7 1.27,-2.413; 8 1.27,2.413; 9 2.54,-2.413; 10 2.54,2.413
1X01 = drill 1.016 pad 1.88: 1 0,0
IND_BOURNS_SRR1260 = smd 2.896 x 5.41: 1 -4.851,0; 2 4.851,0
JST-2-SMD = smd 1 x 4.6: 1 -1,-3.7; 2 1,-3.7 | smd 1.6 x 3.4: NC1 -3.4,1.5; NC2 3.4,1.5
0603-RES = smd 1.1 x 1: 1 -0.85,0; 2 0.85,0
EXBS8V = smd 0.75 x 1.1: 1 -1.905,-1.07; 2 -0.635,-1.07; 3 0.635,-1.07; 4 1.905,-1.07; 5 1.905,1.07; 6 0.635,1.07; 7 -0.635,1.07; 8 -1.905,1.07
CF-LD-1DC4-AR2W = drill 0.85: 1 -2.54,2.54; 2 -2.54,-2.54; 3 2.54,2.54; 4 2.54,0; 5 2.54,-2.54
TACTILE_SWITCH_SMD_4.6X2.8MM = smd 0.9 x 1: 1 -2.05,-0.8; 2 2.05,-0.8; 3 2.05,0.8; 4 -2.05,0.8
TACTILE_SWITCH_PTH_6.0MM = drill 1.016 pad 1.88: 1 -3.251,2.261; 2 3.251,2.261; 3 -3.251,-2.261; 4 3.251,-2.261
B1,27 = smd 1.27 x 1.27: TP 0,0
PWP0016K_N = smd 1.7 x 0.35: 1 -2.85,2.275; 2 -2.85,1.625; 3 -2.85,0.975; 4 -2.85,0.325; 5 -2.85,-0.325; 6 -2.85,-0.975; 7 -2.85,-1.625; 8 -2.85,-2.275; 9 2.85,-2.275; 10 2.85,-1.625; 11 2.85,-0.975; 12 2.85,-0.325; 13 2.85,0.325; 14 2.85,0.975; 15 2.85,1.625; 16 2.85,2.275 | smd 2.46 x 2.31: 17 0,0
SOT23-5 = smd 0.55 x 1.2: 1 -0.95,-1.3; 2 0,-1.3; 3 0.95,-1.3; 4 0.95,1.3; 5 -0.95,1.3
BC840M = smd 0.305 x 0.305: A0 0.66,5.966; A1 0.66,5.153; A2 0.66,4.366; A3 0.66,3.553; A4 0.66,2.765; A5 0.66,1.953; A6 0.66,1.165; A7 0.66,0.352; B0 1.448,5.966; B1 1.448,5.153; B2 1.448,4.366; B3 1.448,3.553; B4 1.448,2.765; B5 1.448,1.953; B6 1.448,1.165; B7 1.448,0.352; C0 2.261,5.966; C1 2.261,5.153; C2 2.261,4.366; C3 2.261,3.553; C4 2.261,2.765; C5 2.261,1.953; C6 2.261,1.165; C7 2.261,0.352; D0 3.048,5.966; D1 3.048,5.153; D2 3.048,4.366; D3 3.048,3.553; D4 3.048,2.765; D5 3.048,1.953; D6 3.048,1.165; D7 3.048,0.352; E0 3.861,5.966; E1 3.861,5.153; E2 3.861,4.366; E3 3.861,3.553; E4 3.861,2.765; E5 3.861,1.953; E6 3.861,1.165; E7 3.861,0.352; F0 4.648,5.966; F1 4.648,5.153; F2 4.648,4.366; F3 4.648,3.553; F4 4.648,2.765; F5 4.648,1.953; F6 4.648,1.165; F7 4.648,0.352; G0 5.461,5.966; G1 5.461,5.153; G2 5.461,4.366; G3 5.461,3.553; G4 5.461,2.765; G5 5.461,1.953; G6 5.461,1.165; G7 5.461,0.352; H0 6.248,5.966; H1 6.248,5.153; H2 6.248,4.366; H3 6.248,3.553; H4 6.248,2.765; H5 6.248,1.953; H6 6.248,1.165; H7 6.248,0.352
VSSOP-8 = smd 1.27 x 0.279: 1_1!OE -1.673,0.862; 2_1A -1.673,0.254; 3_2Y -1.673,-0.354; 4_GND -1.673,-0.962; 5_2A 1.773,-0.962; 6_1Y 1.773,-0.354; 7_2!OE 1.773,0.254; 8_VCC 1.773,0.862
FC-12M = smd 0.7 x 1.4: 1 -0.85,0; 2 0.85,0

### Placement (x,y rotation side)
C1  7.62,18.99 0 top
C2  7.94,6.92 180 top
C3  15.56,8.51 0 top
C6  34.92,30.73 270 top
C9  32.7,10.86 180 top
C10  15.18,44.07 270 top
C12  8.73,44.1 90 top
C17  32.64,16.61 180 top
C18  33.94,25.27 90 top
C19  36.86,10 180 top
C20  28.1,30.7 270 top
D1  24.67,2.41 0 top
D2  BLUE  [LED-0603']  21.91,50.1 180 top
D3  29.15,17.08 0 top
D7  18.1,30.42 90 top
D8  14.29,30.42 90 top
D9  RED  [LED-0603']  6.35,31.37 180 top
D10  26.64,24.8 270 top
IC1  18.1,36.77 0 top
J1  16.83,2.16 180 top
J2  30.48,39.31 180 top
J4  14.61,50.83 180 top
J5  38.1,40.26 90 top
J6  32.7,2.48 0 top
J7  39.88,33.15 90 top
J8  41.59,45.02 0 top
L4  18.1,18.99 270 top
POWER_IN  7.49,37.66 90 top
Q2  24.77,31.05 0 top
R1  17.59,44.1 270 top
R11  22.7,43.97 270 top
R15  20.67,43.97 270 top
RN2  27.94,45.34 0 top
RPROG  6.16,45.82 0 top
S1  37.78,48.83 270 top
S2  38.2,25.34 180 top
S3  6.06,26.23 180 top
S4  46.35,26.35 0 top
TP1  40,10.1 0 top
TP4  22.86,3.75 0 top
TP5  27.84,3.65 0 top
U1  7.62,12.64 270 top
U2  11.94,44.32 270 top
U3  36.2,18.99 270 top
U5  24.45,8.51 0 top
Y2  33.34,13.91 90 top

### Tracks (layer width: path | path; a pad name or v marks a point on that pad's centre or on a via)
3.3V  (via drill 0.35)
  Top 0.152: v29.53,19.27 30.55,19.27 31.55,20.27 v31.46,20.35 31.78,20.35 32.48,21.05 33.81,21.05 36.54,18.33 U3.A7 | v35.18,15.82 35.5,15.51 38.3,15.51 38.53,15.28 38.53,14.97 38.15,14.59 U3.F5 | v37.53,11.08 37.73,10.88 37.71,10.86 C19.1 37.81,10.1 TP1.TP | 32.73,33.94 34.9,31.77 C6.1 | J5.2 37.63,39.29 37.33,39.29 37.16,39.12 32.7,39.12 32.49,38.91 32.49,38.51 J2.2
  Top 0.2: v40.32,29.15 40.96,29.78 41.47,29.78 J7.1
  Top 0.457: IC1.2 24.08,40.7 24.08,40.74 26.04,42.69 RN2.1 RN2.2 27.82,43.76 27.82,43.56 28.04,43.34 30.7,43.34 v31.75,44.39
  Top 0.61: J2.2 32.02,36.77 33.02,35.77 v33.02,34.23
  Top 0.813: J7.1 40.77,30.61 40,31.37 40,35.81 v39.37,36.45
  Top 0.914: v33.02,34.23 32.73,33.94
  Bottom 0.2: v29.53,19.27 29.62,19.37 33.24,19.37 33.66,19.78 34.77,19.78 35.56,18.99 | v40.32,29.15 40.32,24.07 41.27,23.11 42.23,23.11 42.77,22.57 42.77,19.53 42.42,19.18 35.56,19.18 35.56,18.99 | 35.56,18.99 35.56,16.21 v35.18,15.82 35.81,15.19 35.81,12
  Bottom 0.254: 35.81,12 36.73,11.08 v37.53,11.08
  Bottom 0.457: v33.02,34.23 33.02,35.37 37.8,40.16 37.8,41.95 36.92,42.83 33.3,42.83 v31.75,44.39
  Bottom 0.813: v33.02,34.23 35.24,36.45 v39.37,36.45
5V  (via drill 0.35)
  Top 0.152: 8.57,9.79 U1.13 U1.14
  Top 0.254: U5.8_VCC 26.41,9.18 27.58,9.18 28.64,8.12 28.64,6.55
  Top 0.305: 28.64,6.55 28.64,6.54 J6.1
  Top 0.61: U1.13 8.26,9.79 | 8.26,9.79 8.57,9.79 | 8.57,9.79 U1.15 | 8.26,9.79 8.79,9.25 C2.1 10.78,6.92 11.71,5.98 15.5,5.98 | C3.A 18.03,8.19 15.82,5.98 15.5,5.98 | 15.5,5.98 17.16,4.42 20.78,0.81 25.26,0.81 26.93,2.48 J6.1 | 8.57,9.79 9.26,9.1 9.26,8.85 11.75,6.37 J1.3 | D8.C D7.C 8.5,32.57 | v6.03,21.84 4.76,23.11 4.76,28.83 8.5,32.57 | D9.A 8.42,32.57 8.5,32.57
  Bottom 0.61: v6.03,21.84 6.03,21.02 4.91,19.9 4.91,9.52 11.75,2.67 J1.3
D+  (via drill 0.35)
  Top 0.152: U3.A4 38.96,19.46 36.34,22.08 34.37,22.08
  Top 0.203: v19.37,41.72 20.67,43.02 R15.2 | 34.37,22.08 33.06,23.39 33.06,27.98 31.79,29.26 31.79,32.37 30.22,33.94 v25.97,33.94
  Bottom 0.152: v25.97,33.94 25.97,36.39 21.91,40.45 20.64,40.45 v19.37,41.72
D-  (via drill 0.35)
  Top 0.152: U3.A5 38.1,18.37 38.1,18.99 37.49,19.59
  Top 0.203: R11.2 22.7,42.86 v20.92,41.08 | 37.49,19.59 37.46,19.62 36.2,19.62 32.66,23.15 32.66,27.72 31.43,28.95 31.43,32.13 30.17,33.4 26.42,33.4 v26.42,33.11
  Bottom 0.152: v26.42,33.11 26.52,33.21 26.52,36.48 21.91,41.08 v20.92,41.08
GND  (via drill 0.35)
  Top 0.152: J7.7 42.29,34.86 J7.9 41.35,35.69 39.77,37.27 37.25,37.27 35.85,38.67 | 42.29,33.27 J7.5 J7.3 | U3.H4 U3.G4 U3.G5 | S2.1 40.24,26.52 v38.39,28.38 | S2.2 35.71,26.14 35.24,26.61 35.24,26.92 v35.56,27.24 | U3.G0 41.78,13.91 41.19,13.91 40.96,13.67 40.96,11.05 38.96,11.05 | 35.85,38.67 35.85,38.81 33.8,38.81 J2.1 | 35.85,38.67 35.85,30.75 C6.2 | U3.G5 U3.G6 U3.H6 | U3.G5 U3.H5 | U3.H6 U3.H5 | U3.H7 U3.H6 | U3.H5 38.15,12.08 38.85,11.38 | U3.H4 38.96,11.98 | U3.H6 37.36,11.68 37.01,11.33 36.55,11.33 | v25.4,19.3 v25.4,17.72 25.4,17.4 25.1,17.09 | J5.1 43.31,38.76 | 32.2,6.04 32.2,8.99 32.57,9.37 34.61,9.37 35.05,8.92 v35.78,8.92 35.78,9.77 C19.2 | v30.45,9.91 30.45,9.54 29.06,8.15 29.06,6.99 | U5.4_GND 23.18,7.14 v23.18,6.29 | v40.54,11.14 39.7,11.14 39.65,11.1 39.21,11.1 38.9,11.41 38.9,11.85 38.96,11.91 U3.H4 | 28.65,15.7 28.52,15.84 | 29.64,18.46 28.65,18.46 28.52,18.33 28.52,15.84 | 28.65,15.7 28.68,15.7 29.17,15.22 | C17.2 30.91,15.77 30.91,11.12 29.35,9.57 27.72,9.57 26.77,10.51 26.77,10.95 28.16,12.34 28.16,13.38 28.3,13.52 29.34,13.52 29.49,13.66 | 29.64,18.46 29.91,18.19 v30.19,18.19 29.93,18.46 29.64,18.46 | v30.35,20.35 30.18,20.35 29.75,20.79 28.36,20.79 25.1,17.53 25.1,17.09 | 29.17,15.22 29.14,15.22 28.65,15.7 | 29.49,13.66 29.62,13.79 29.62,14.77 29.17,15.22 | 29.49,13.66 28.44,13.66 27.86,13.08 27.86,12.4 27.42,11.96 26.23,11.96 25.1,13.1 25.1,17.09 | 28.52,15.84 28.45,15.91 v28.16,15.91 | RPROG.2 7.87,44.95 C12.2
  Top 0.2: 31.8,12.03 C9.2
  Top 0.203: v38.7,23.3 38.66,23.26 35.89,23.26 35.24,23.91 35.24,26.14 | 35.56,26.14 35.56,26.45 | 31.31,24.38 v32.04,23.65 | v25.4,19.3 25.4,19.49 28.26,22.35 v28.26,22.48 | C20.2 28.1,28.85 29.07,27.88 v29.53,27.88 30.16,27.24
  Top 0.254: 38.96,11.05 38.96,11.28 38.85,11.38 38.85,11.87 38.96,11.98 | C19.2 36.01,10.8 36.55,11.33 U3.H7 | U5.4_GND 24.12,7.55 25.4,8.83 26.16,8.83 U5.7_2!OE 24.51,8.76 23.81,9.46 22.86,9.46 U5.1_1!OE 25.04,11.64 25.04,17.11 25.4,17.47 v25.4,17.72 | 29.06,6.99 31.03,5.02 32.07,5.02 32.51,5.46 32.51,5.73 | 32.2,6.04 32.51,5.73 | 32.51,5.73 34.53,5.73 J6.3 38.04,2.22 J6.4 | C3.C 14.29,8.51 v15.56,7.24 | v10.16,5.65 8.36,5.65 C2.2 | 30.16,27.24 31.31,26.09 31.31,24.38
  Top 0.305: C17.2 31.42,16.29 31.42,15.48 31.43,15.47 v31.43,15.18 | v31.43,13.59 31.43,12.4 31.8,12.03 | 25.08,45.51 28.7,45.51 29.26,44.95 29.26,44.86 RN2.4 30.77,44.27 31.5,44.99 35.28,44.99 36.84,46.56 36.84,46.68 37.39,47.23 41.14,47.23 43.08,45.29 43.08,38.58 43.31,38.35 | J4.5 13.3,48.48 | S4.1 43.1,29.46 43.23,29.59 43.23,31.3 42.66,31.88 J7.3
  Top 0.406: 42.29,33.27 42.29,34.86
  Top 0.457: U1.3 U1.5 | R1.1 18.98,46.34 24.1,46.34 24.93,45.51 25.08,45.51
  Top 0.508: U1.3 8.6,16 8.6,18.86
  Top 0.61: C6.2 34.92,27.36 S2.2 35.56,26.14 35.24,26.14 | C18.2 34.27,26.45 35.56,26.45 | C12.2 9.37,44.95 9.99,44.32 U2.2 10.7,44.39 11.75,44.39 | 11.75,44.39 11.75,43.12 12.38,42.48 14.44,42.48 C10.2 15.56,42.84 15.56,38.64 13.57,36.66 POWER_IN.1 16.16,36.66 IC1.1 19.29,33.52 19.29,31.74 18.1,30.55 D7.A v16.19,28.27 D8.A 10.93,28.27 10.71,28.48 10.71,29.07 9.89,29.88 8.74,29.88 7.92,29.07 7.92,27.91 9.31,26.51 S3.1 | 43.31,38.76 43.31,38.35 43.31,35.88 42.29,34.86 | 8.6,18.86 C1.2 v10.16,18.99 | C2.2 6.65,7.36 U1.11 6.66,9.8 6.66,10.72 7.62,11.68 U1.17 8.61,12.64 12.74,8.51 C3.C 12.22,9.37 v12.22,10.89 | U1.4 7.43,16 7.43,16.03 8.56,16.03 8.6,16 | 13.3,48.48 13.3,47.62 13.34,47.58 13.34,47.56 11.75,45.97 11.75,44.39
  Bottom 0.152: 35.24,26.92 v35.56,27.24 36.7,28.38 v38.39,28.38 | v16.19,28.27 16.19,25.02 v10.16,18.99
  Bottom 0.203: 35.24,26.92 35.24,26.86 v32.04,23.65 | v28.26,22.48 28.26,26.61 v29.53,27.88
  Bottom 0.254: v31.43,15.18 30.8,14.54 28.57,14.54 v25.4,17.72 | 18.1,2.16 19.05,2.16 v23.18,6.29
  Bottom 0.305: v31.43,15.18 v31.43,13.59 31.43,10.89 v30.45,9.91
  Bottom 0.61: v25.4,19.3 25.08,18.99 v10.16,18.99 10.16,12.95 v12.22,10.89
  Bottom 0.813: J1.1 18.1,2.16
  pour Top (isolate 0.005): 3.49,53.28 43.21,53.28 43.21,19.27 35.85,19.27 35.85,11.59 43.43,11.59 43.43,-0.38 3.49,-0.38
  pour Bottom (isolate 0.005): 3.17,53.28 43.18,53.28 43.18,19.3 35.94,19.3 35.94,11.56 43.43,11.56 43.43,-0.06 3.17,-0.06
HEADLAMP_3V3  (via drill 0.35)
  Top 0.152: U3.D7 36.07,15.94 33.97,18.03 31.3,18.03 30.27,17 30.27,11.47 29.53,10.73 v27.3,10.73 | v21.59,2.79 22.54,3.75 TP4.TP
  Top 0.254: U5.5_2A 26.85,6.92 v26.99,6.92
  Bottom 0.152: v21.59,2.79 23.71,4.91 23.71,6.51 23.4,6.82 22.96,6.82 22.23,7.56 22.23,7.62 20.66,9.19 20.66,9.63 21.09,10.06 26.31,10.06
  Bottom 0.203: v27.3,10.73 26.99,10.73 26.31,10.06
  Bottom 0.254: v26.99,6.92 27.16,7.1 27.16,8.43 28.54,9.81 28.54,10.32 28.18,10.68 27.36,10.68 v27.3,10.73
HEADLAMP_5V  (via drill 0.35)
  Top 0.254: v20.64,8.19 22.74,8.19 U5.3_2Y
  Bottom 0.254: v20.64,8.19 20.07,8.19 J1.2
LED_1  (via drill 0.35)
  Top 0.152: U3.D4 39.06,16.04 39.24,16.04 39.55,16.34 39.91,16.34 40.13,16.57 40.13,19.7 v40.1,19.73 | v29.37,20.13 28.91,19.67 28.29,19.67 27.25,18.64 27.25,18.31 25.72,16.78 25.72,15.18 v26.04,14.86 | v28.45,5.75 25.86,3.16 D1.C
  Bottom 0.152: v40.1,19.73 35.88,19.73 35.48,20.13 33.53,20.13 33.21,19.81 29.67,19.81 v29.37,20.13 | v26.04,14.86 26.04,14.66 25.19,13.81 25.19,13.37 25.71,12.85 27.78,12.85 29.53,11.1 29.53,6.83 v28.45,5.75
LED_2
  Top 0.152: U3.C4 38.69,16.73 38.3,17.11 37.99,17.11 37.74,16.86 37.74,16.57 37.52,16.34 36.09,16.34 34.1,18.34 31.18,18.34 30.45,17.61 29.37,17.61 D3.C
N$1  (via drill 0.35)
  Top 0.152: D1.A 24.67,2.04 24.04,2.67 24.04,4.04 20.11,7.97 20.11,9.68 24.54,14.11 24.54,24.34 23.28,25.6 23.28,27.58 23.14,27.72 v23.06,27.72 | v25.08,47.24 25.92,46.41 RN2.8
  Bottom 0.152: v23.06,27.72 23.06,35.18 19.79,38.45 19.79,40.55 18.84,41.5 18.84,41.94 19.15,42.25 21.68,42.25 25.08,45.66 v25.08,47.24
N$2
  Top 0.152: C9.1 33.34,11.12 Y2.1 | 35.56,14.34 U3.F7
  Top 0.254: 35.56,14.34 34.28,13.06 Y2.1
N$3
  Top 0.254: U1.2 9.4,15.64
  Top 0.457: U1.1 U1.2
  Top 0.61: L4.2 11.25,14.13 10.12,15.26 | 10.12,15.26 U1.1 | 9.4,15.64 9.4,16 9.43,16.03 9.84,16.03 10.12,15.76 10.12,15.26
N$4  (via drill 0.3, 0.35)
  Top 0.152: 26.42,30.66 v25.91,31.17
  Top 0.61: D10.C 25.71,28.22 Q2.2 26.42,30.66 27.37,31.6 C20.1 | IC1.3 18.9,38.67 v20.32,38.67
  Bottom 0.61: v20.32,38.67 25.21,33.78 25.21,33.24 25.91,32.55 v25.91,31.17
N$8  (via drill 0.35)
  Top 0.152: D3.A 29.71,15.77 v29.71,15.49 | v26.1,48.07 27.3,46.86 RN2.7
  Bottom 0.152: v29.71,15.49 27.28,17.92 27.28,31.07 27.3,31.1 27.3,46.86 v26.1,48.07
N$11  (via drill 0.35)
  Top 0.152: RPROG.1 5.64,45.81 6.37,46.54 10.73,46.54 v10.79,46.61 | v13.65,46.61 13.65,45.69 U2.5
  Bottom 0.152: v10.79,46.61 v13.65,46.61
N$12  (via drill 0.35)
  Top 0.152: J4.2 15.25,47.26 v14.92,46.93 | v23.81,45.66 22.98,44.82 R11.1
  Bottom 0.152: v14.92,46.93 14.92,45.25 13.18,43.51 13.18,38.9 13.75,38.32 14.57,38.32 21.9,45.66 v23.81,45.66
N$13  (via drill 0.35)
  Top 0.152: D9.C 7.33,33.23 7.79,33.23 9.74,35.18 v14.92,35.18 | v30.8,46.61 30.6,46.41 RN2.5
  Bottom 0.152: v30.8,46.61 31.35,47.16 35.69,47.16 37.42,45.42 38.14,45.42 38.65,45.93 38.65,46.65 35.62,49.68 16.93,49.68 14.39,47.15 14.39,45.16 12.87,43.63 12.87,38.77 14.92,36.72 v14.92,35.18
N$14
  Top 0.152: U2.1 11.21,45.85 11.21,46.2 11.33,46.31 11.33,47.91 11.15,48.09 11.15,48.88 11.71,49.44 14.58,49.44 15.15,50 18.4,50 18.5,50.1 D2.C
N$15
  Top 0.152: RN2.6 24.88,50.1 D2.A
N$16  (via drill 0.35)
  Top 0.152: J4.3 14.83,48.7 14.83,49.25 15.06,49.49 18.22,49.49 18.56,49.15 v19.05,49.15 | v19.68,44.39 20.12,44.82 R15.1
  Bottom 0.152: v19.05,49.15 19.05,48.95 13.48,43.38 13.48,39.02 13.88,38.63 14.44,38.63 14.84,39.02 14.84,39.54 v19.68,44.39
N$17
  Top 0.152: C17.1 33.34,16.4 Y2.2 33.36,14.72 36.7,14.72 37.09,14.34 U3.F6
PIN_01  (via drill 0.3, 0.35)
  Top 0.152: U3.D1 41.28,15.94 40.97,16.25 40.97,17.14 | 40.97,17.14 40.97,18.99 41.51,19.53 41.51,20.41 v41.43,20.48 | v30.64,22.19 30.89,21.94 v32.96,21.94 | J2.3 | J2.3 31.02,36.42 v31.85,35.59 | v41.76,12.27 41.76,12.88 41.45,13.18 41.45,13.49 U3.G1 | v42.82,17.6 42.37,17.14 40.97,17.14
  Bottom 0.152: v32.96,21.94 34.8,21.94 35.81,20.92 40.99,20.92 v41.43,20.48 | v30.64,22.19 29.95,22.88 29.95,25.12 31.62,26.8 31.62,35.37 v31.85,35.59 | v41.76,12.27 41.76,16.54 v42.82,17.6
PIN_02  (via drill 0.3, 0.35)
  Top 0.152: U3.E0 42.26,15.02 42.45,15.02 42.85,14.62 42.85,10.92 42.44,10.52 v42.54,10.41 | J2.4 30.02,35.8 v30.35,35.46 | U3.C6 36.93,17.16 36.93,17.7 36.7,17.92 36.41,17.92 35.54,18.8 35.54,18.84 35.18,19.19 v34.48,19.19 33.1,20.57 32.7,20.57 v32.7,20.52 | v32.61,16.87 32.61,15.47 32.31,15.16 32.31,11.81 32.77,11.35 v32.77,10.76 | v32.7,8.78 32.99,9.06 34.48,9.06 35.72,7.83 v35.86,7.97
  Bottom 0.152: v42.54,10.41 41.91,9.78 38.44,9.78 36.63,7.97 v35.86,7.97 | v34.48,19.19 34.48,18.73 v32.61,16.87 | v32.7,8.78 32.7,10.7 v32.77,10.76 | v32.7,20.52 40.64,20.52 41.21,19.95 41.65,19.95 41.96,20.26 41.96,20.7 40.61,22.06 39.2,22.06 38.17,23.09 38.17,27.42 38.92,28.16 38.92,28.6 38.61,28.91 35.39,28.91 32.38,31.92 32.38,35.38 37.35,40.34 37.35,41.76 36.73,42.38 36.24,42.38 30.62,36.75 30.62,35.73 v30.35,35.46
PIN_03  (via drill 0.3, 0.35)
  Top 0.152: v41.59,11.37 42.54,12.32 42.54,14.5 42.32,14.72 41.75,14.72 U3.E1 | J2.5 28.96,38.02 28.96,36.04 29.02,36 v29.53,35.5 v34.29,30.73 | U3.C7 36.14,16.73 34.23,18.64 34.13,18.64 33.85,18.93 v33.75,18.93 | v28.57,20.26 28.26,20.26 25.93,17.93 25.93,17.5 25.41,16.98 25.41,13.89 v25.72,13.59
  Bottom 0.152: v28.57,20.26 28.84,19.99 28.84,19.21 29.31,18.74 33.56,18.74 v33.75,18.93 | v34.29,30.73 40.64,30.73 40.89,30.48 40.89,27.94 43.72,25.11 44.67,25.11 45.09,24.7 45.09,23.75 43.81,22.48 43.81,19.51 43.33,19.02 43.33,17.39 42.54,16.6 42.54,12.32 v41.59,11.37 41.59,10.1 38.33,10.1 36.85,8.61 36.84,8.61 36,9.45 35.56,9.45 35.14,9.03 35.14,7.39 34.46,6.71 31.9,6.71 29.84,8.77 29.84,11.54 27.79,13.59 v25.72,13.59
PIN_04  (via drill 0.35)
  Top 0.152: U3.F4 39.34,13.96 39.34,11.71 v39.43,11.63 | v28.57,35.5 28.26,35.81 28.26,37.8 J2.6
  Bottom 0.152: v39.43,11.63 38.82,11.63 37.75,10.55 34.67,10.55 32.23,12.99 32.23,15.2 31.73,15.71 31.03,15.71 27.58,19.16 27.58,30.95 27.97,31.34 28.39,31.75 28.39,35.31 v28.57,35.5
RESET  (via drill 0.35)
  Top 0.152: S2.3 36.83,24.54 36.91,24.62 | U3.B4 38.53,17.97 38.53,19.02 36.1,21.45 v36.1,21.51 | v39.31,21.53 40.96,21.53 40.96,23.37 40.77,23.57 40.77,24.02 S2.4 40.16,24.62 36.91,24.62 | J7.10 37.34,35.69 36.58,34.92 36.58,28.13 37.15,27.56 37.15,24.85 36.91,24.62
  Bottom 0.152: v36.1,21.51 36.1,21.37 39.15,21.37 v39.31,21.53
SCL  (via drill 0.35)
  Top 0.152: U3.D6 37.61,15.94 38.02,16.34 39.12,16.34 39.37,16.59 39.37,18.48 39.37,18.49 39.37,19.62 36.35,22.64 v34.96,22.64 | v36.51,41.85 38.01,41.85 J5.4
  Bottom 0.152: v34.96,22.64 32.8,22.64 31.1,20.93 29.96,20.93 29.58,21.31 29.58,25.39 31.23,27.04 31.23,36.45 35.14,40.36 36.73,40.36 37.04,40.67 37.04,41.32 v36.51,41.85
SDA  (via drill 0.35)
  Top 0.152: v34,12.2 34.23,12.2 35.99,13.96 37.52,13.96 37.74,14.18 37.74,14.2 37.77,14.22 37.77,14.72 U3.E6 | v36.51,40.89 37.96,40.89 J5.3
  Bottom 0.152: v34,12.2 32.8,13.4 32.8,15.09 31.88,16.01 31.35,16.01 27.94,19.42 27.94,20.78 28.79,21.62 28.79,25.35 30.93,27.48 30.93,36.63 35.19,40.89 v36.51,40.89
STRIP_3V3  (via drill 0.35)
  Top 0.152: U3.E7 35.13,15.13 34.29,15.96 34.29,17.24 33.81,17.72 31.53,17.72 30.6,16.79 30.6,11.25 29.45,10.1 v27.94,10.1 | TP5.TP 27.21,3.65 26.99,3.43 26.88,3.43 v26.69,3.24
  Top 0.254: U5.2_1A 22.71,8.83 21.77,8.83 v21.19,9.41
  Bottom 0.152: v27.94,10.1 27.94,9.71 26.46,8.23 26.46,3.47 v26.69,3.24
  Bottom 0.254: v27.94,10.1 27.52,9.67 21.46,9.67 v21.19,9.41
STRIP_5V  (via drill 0.35)
  Top 0.254: U5.6_1Y 27.71,8.15 v27.74,8.19
  Bottom 0.254: J6.2 34.68,2.22 33.13,0.67 32.14,0.67 27.49,5.33 27.49,6.07 27.74,6.33 v27.74,8.19
SWDCLK
  Top 0.152: J7.4 38.42,30.92 38.42,29.24 41.46,26.2 41.46,23.88 41.62,23.72 41.62,21.53 43.34,19.81 43.34,17.34 42.32,16.32 41.75,16.32 U3.C1
SWDIO
  Top 0.152: J7.2 37.15,30.61 37.15,27.99 37.45,27.68 37.45,27.37 39.55,25.27 40.87,25.27 41.11,25.02 41.11,23.72 41.27,23.56 41.27,21.43 42,20.7 42,18.71 41.78,18.48 41.78,17.97 U3.B1
SWITCH_1  (via drill 0.35)
  Top 0.152: U3.D5 38.27,15.81 38.43,15.81 38.74,15.51 39.12,15.51 39.34,15.28 39.34,14.99 39.62,14.72 39.91,14.72 40.13,14.5 40.13,14.23 40.4,13.96 40.72,13.96 40.97,14.21 40.97,15.28 41.19,15.51 42.39,15.51 43.19,14.71 43.19,10.2 42.54,9.56 v42.54,9.46 | v18.41,26.61 17.62,27.4 11.04,27.4 9.95,28.49 S3.3
  Bottom 0.152: v18.41,26.61 25.18,19.84 25.62,19.84 25.93,19.52 25.93,19 24.87,17.94 24.87,13.26 26.86,11.26 28.1,11.26 28.9,10.46 28.9,6.98 27.85,5.93 27.85,5.47 28.1,5.22 38.3,5.22 v42.54,9.46
SWITCH_2  (via drill 0.3, 0.35)
  Top 0.152: U3.B7 36.09,17.54 v35.01,18.62 | v35.17,11.89 v35.17,11.88 35.17,10.2 v34.99,10.02 | v44.34,24.32 44.02,24 43.12,24 43.12,24.08 S4.3
  Bottom 0.152: v35.01,18.62 35.01,16.4 34.65,16.04 34.65,15.61 35.17,15.08 35.17,12.3 35.17,12.29 v35.17,11.89 | v44.34,24.32 43.7,23.69 43.7,23 43.5,22.8 43.5,19.62 40.08,16.2 40.08,11.51 39.65,11.07 38.82,11.07 37.77,10.02 v34.99,10.02
SWO
  Top 0.152: U3.D0 42.48,15.94 43.65,17.11 43.64,17.12 43.64,19.94 41.93,21.65 41.93,23.84 41.93,23.85 41.93,26.59 38.73,29.78 38.73,32 37.59,33.15 J7.6
VBAT
  Top 0.152: 35.49,42.23 35.81,42.23 39.86,46.29 39.87,46.29 S1.3 | 6.65,18.86 U1.6
  Top 0.457: 6.61,15.52 U1.6 6.36,15.49
  Top 0.559: 6.61,18.83 6.61,15.52
  Top 0.61: J8.1 S1.3 39.55,46.29 35.49,42.23 35.17,41.92 26.23,41.92 24.77,40.45 Q2.3 23.72,31.11 23.13,31.11 22.86,30.84 22.86,28.6 L4.1 12.12,23.84 11.54,23.27 11.05,23.27 C1.1 6.65,18.86 | 6.36,15.49 6.33,15.46 5.38,15.46 U1.8 | U1.8 5.35,17.56 6,18.21 | U1.7 6,18.21 | 6,18.21 6.61,18.83 | U1.9 U1.8
VBAT_RAW  (via drill 0.6)
  Top 0.152: 11.39,38.57 POWER_IN.2
  Top 0.61: U2.3 8.73,43.37 C12.1 11.19,40.79 | POWER_IN.2 11.19,40.79 | v14.16,39.31 12.26,39.31 11.39,40.17 | 11.19,40.79 11.39,40.59 11.39,40.17 | 11.39,40.17 11.39,38.57
  Bottom 0.61: v14.16,39.31 14.16,43.31 17.65,46.8 23.11,46.8 25.15,48.83 35.24,48.83 S1.4
VBUS  (via drill 0.35)
  Top 0.152: U3.B5 38.15,17.86 38.06,17.95 37.2,17.95 36.98,18.17 36.98,19.07 36.76,19.29 36.06,19.29 33.95,21.4 30.29,21.4 v30.16,21.53 | 15.14,45.19 15.24,45.19 C10.1 | RN2.3 28.55,44.27 27.78,45.05 24.3,45.05 23.3,44.05 22.11,44.05 21.4,44.75 21.4,45.47 21.26,45.6 19.94,45.6 R1.2
  Top 0.305: R1.2 16.84,43.25 16.59,43.51
  Top 0.406: v33.97,23.4 33.94,23.43 33.94,24.26
  Top 0.457: J4.1 15.91,46.65
  Top 0.61: 15.14,45.19 15.14,45.89 15.91,46.65 | U2.4 13.48,43.37 13.52,43.34 13.56,43.34 15.16,44.94 C10.1 16.59,43.51 17.46,42.63 17.46,41.57 v18.89,40.14 | v30.16,21.53 29.53,22.16 29.53,22.48 28.58,23.43 27.07,23.43 D10.A v23.82,25.82 Q2.1
  Top 0.813: 33.94,24.26 C18.1
  Bottom 0.254: v33.97,23.4 33,23.4 31.15,21.55 31.18,21.53 v30.16,21.53
  Bottom 0.61: v23.82,25.82 18.73,30.9 18.73,40.26 18.77,40.26 v18.89,40.14

### Text on the board
tPlace: Charging | - | + | swarms.city | - | + | NRF | D | GND | 5V | D | GND | 5V | -
bPlace: Swarm Lights / V12 4/28/2022 / starlings.technology